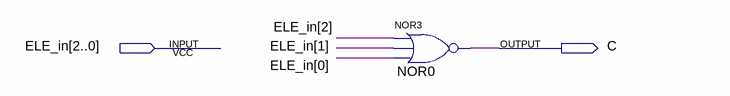
[diagram p0: schematic sheet]
// Quartus schematic DECOD_ELE_C.bdf as structural Verilog: 1 symbols, 2 pins
module DECOD_ELE_C (
  input  [2:0] ELE_in,
  output C
);

  nor NOR0 (C, ELE_in[2], ELE_in[1], ELE_in[0]);
endmodule
